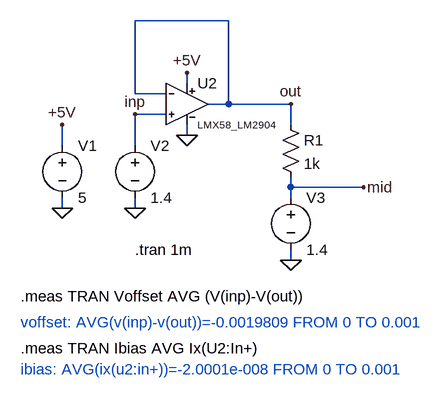
[diagram p0: schematic 03-LM358 ti offset voltage.asc]
03-LM358 ti offset voltage.asc, the LTspice schematic file:
Version 4
SHEET 1 880 680
WIRE 112 16 -32 16
WIRE 48 112 48 96
WIRE -32 128 -32 16
WIRE 16 128 -32 128
WIRE 112 144 112 16
WIRE 112 144 80 144
WIRE 208 144 112 144
WIRE 16 160 -32 160
WIRE 208 176 208 144
WIRE 48 192 48 176
WIRE -144 208 -144 176
WIRE -32 208 -32 160
WIRE 208 272 208 256
WIRE 320 272 208 272
WIRE 208 288 208 272
WIRE -144 304 -144 288
WIRE -32 304 -32 288
WIRE 208 384 208 368
FLAG 48 192 0
FLAG -144 304 0
FLAG -144 176 +5V
FLAG 48 96 +5V
FLAG -32 304 0
FLAG 208 384 0
FLAG 208 144 out
FLAG -32 160 inp
FLAG 320 272 mid
SYMBOL voltage -144 192 R0
WINDOW 123 0 0 Left 0
WINDOW 39 0 0 Left 0
SYMATTR InstName V1
SYMATTR Value 5
SYMBOL voltage -32 192 R0
WINDOW 123 0 0 Left 0
WINDOW 39 0 0 Left 0
SYMATTR InstName V2
SYMATTR Value 1.4
SYMBOL res 192 160 R0
SYMATTR InstName R1
SYMATTR Value 1k
SYMBOL voltage 208 272 R0
WINDOW 123 0 0 Left 0
WINDOW 39 0 0 Left 0
SYMATTR InstName V3
SYMATTR Value 1.4
SYMBOL LMX58_ti 16 128 R0
WINDOW 3 48 48 Left 1
SYMATTR InstName U2
TEXT -32 368 Left 2 !.tran 1m
TEXT -208 440 Left 2 !.meas TRAN Voffset AVG (V(inp)-V(out))
TEXT -208 480 Left 2 ;voffset: AVG(v(inp)-v(out))=-0.0019809 FROM 0 TO 0.001
TEXT -208 520 Left 2 !.meas TRAN Ibias AVG Ix(U2:In+)
TEXT -208 552 Left 2 ;ibias: AVG(ix(u2:in+))=-2.0001e-008 FROM 0 TO 0.001

The netlist it stands for:
* 03-LM358 ti offset voltage.asc
V1 +5V 0 5
V2 inp 0 1.4
R1 out mid 1k
V3 mid 0 1.4
XU2 inp out +5V 0 out LMX58_LM2904  ; pins In+ In- V+ V- OUT
.tran 1m
.meas TRAN Voffset AVG (V(inp)-V(out))
* voffset: AVG(v(inp)-v(out))=-0.0019809 FROM 0 TO 0.001
.meas TRAN Ibias AVG Ix(U2:In+)
* ibias: AVG(ix(u2:in+))=-2.0001e-008 FROM 0 TO 0.001
.lib C:\Users\HoP\Documents\GitHub\LTspice\02-offset voltage - bias & offset current\02-LM358\lmx58_lm2904_ti.lib
.backanno
.end

* Results of the author's LTspice run, read from the files saved beside the schematic
* Operating Point, zero values left out:
*   V(+5v) = 5 V
*   V(inp) = 1.4 V
*   V(out) = 1.402 V
*   V(mid) = 1.4 V
*   I(R1) = 1.981 µA
*   I(V3) = 1.981 µA
*   I(V2) = 20 nA
*   I(V1) = -352 µA
*   Ix(u2:IN+) = -20 nA
*   Ix(u2:IN-) = -18 nA
*   Ix(u2:VCC) = 352 µA
*   Ix(u2:VEE) = -350 µA
*   Ix(u2:OUT) = -1.963 µA
* From the log:
*   voffset: AVG(v(inp)-v(out))=-0.0019809 FROM 0 TO 0.001
*   ibias: AVG(ix(u2:in+))=-2.0001e-008 FROM 0 TO 0.001